# Altium schematic sheet DISPLAY_GATEWAY.SchDoc
size A
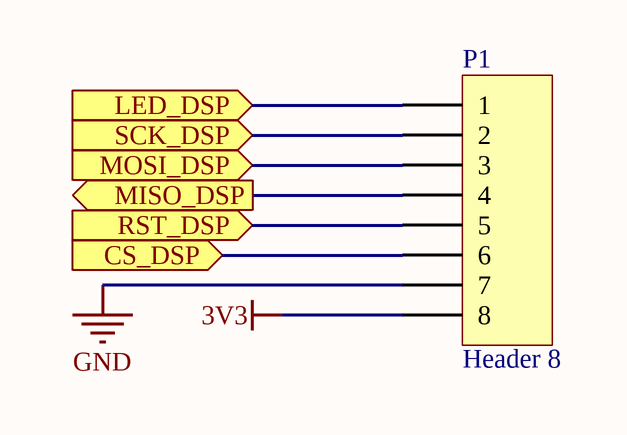
[diagram p0: DISPLAY_GATEWAY.SchDoc]

## Parts
P1  Header 8  [Header 8]

## Ports
CS_DSP (in), LED_DSP (in), MISO_DSP (out), MOSI_DSP (in), RST_DSP (in), SCK_DSP (in)

## Nets
3V3: P1.8
GND: P1.7
CS_DSP: P1.6 ; port CS_DSP
LED_DSP: P1.1 ; port LED_DSP
MISO_DSP: P1.4 ; port MISO_DSP
MOSI_DSP: P1.3 ; port MOSI_DSP
RST_DSP: P1.5 ; port RST_DSP
SCK_DSP: P1.2 ; port SCK_DSP

## Library data of the parts
P1 = Header 8: Header, 8-Pin; LatestRevisionDate: 17-Jul-2002; LatestRevisionNote: Re-released for DXP Platform.; Publisher: Altium Limited